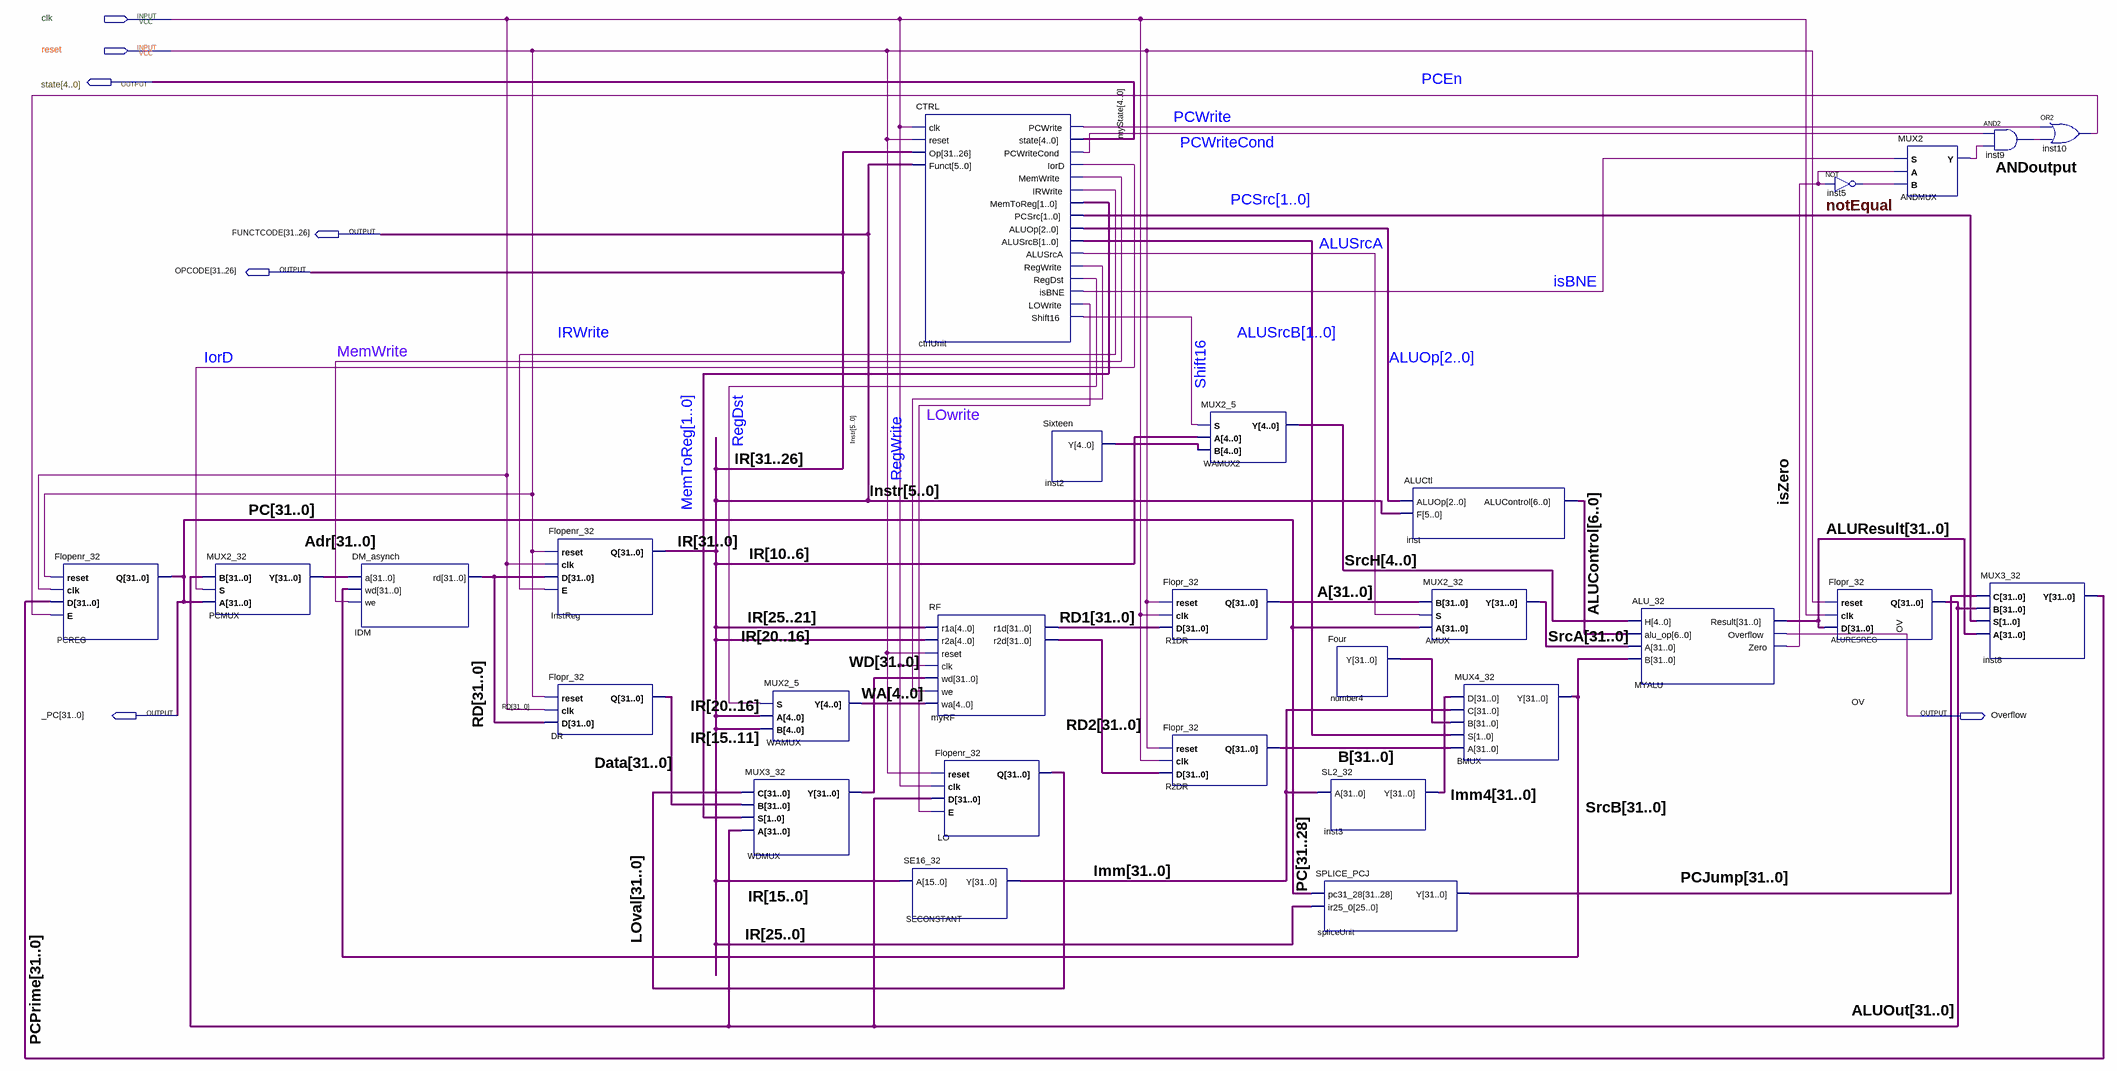
[diagram p0: schematic sheet]
// Quartus schematic CPU_MultiCycle.bdf as structural Verilog: 28 symbols, 7 pins
module CPU_MultiCycle (
  input  clk,
  input  reset,
  output [4:0] state,
  output [31:26] FUNCTCODE,
  output [31:26] OPCODE,
  output [31:0] _PC,
  output Overflow
);

  wire ALUSrcA, ANDMUX_y, ANDoutput, IorD, IRWrite, isBNE, isZero, LOwrite, MemWrite, notEqual, PCEn,
       PCWrite, PCWriteCond, RegDst, RegWrite, Shift16;
  wire [1:0] ALUSrcB, MemToReg, PCSrc;
  wire [2:0] ALUOp;
  wire [4:0] inst2_y, SrcH, WA;
  wire [6:0] ALUControl;
  wire [25:0] IR;
  wire [31:0] A, Adr, ALUOut, ALUResult, B, Data, Imm, Imm4, LOval, number4_y, PCJump, PCPrime, RD, RD1, RD2,
       SrcA, SrcB, WD;

  Flopenr_32 PCREG (.reset(reset), .clk(clk), .D(PCPrime), .E(PCEn), .Q(_PC));
  MUX2_32 PCMUX (.B(ALUOut), .S(IorD), .A(_PC), .Y(Adr));
  DM_asynch IDM (.a(Adr), .wd(SrcB), .we(MemWrite), .rd(RD));
  Flopenr_32 InstReg (.reset(reset), .clk(clk), .D(RD), .E(IRWrite), .Q({OPCODE, IR}));
  Flopr_32 DR (.reset(reset), .clk(clk), .D(RD), .Q(Data));
  MUX3_32 WDMUX (.C(LOval), .B(Data), .S(MemToReg), .A(ALUOut), .Y(WD));
  MUX2_5 WAMUX (.S(RegDst), .A(IR[20:16]), .B(IR[15:11]), .Y(WA));
  SE16_32 SECONSTANT (.A(IR[15:0]), .Y(Imm));
  CTRL ctrlUnit (
    .clk(clk), .reset(reset), .Op(OPCODE), .Funct(FUNCTCODE), .PCWrite(PCWrite), .state(state),
    .PCWriteCond(PCWriteCond), .IorD(IorD), .MemWrite(MemWrite), .IRWrite(IRWrite), .MemToReg(MemToReg),
    .PCSrc(PCSrc), .ALUOp(ALUOp), .ALUSrcB(ALUSrcB), .ALUSrcA(ALUSrcA), .RegWrite(RegWrite), .RegDst(RegDst),
    .isBNE(isBNE), .LOWrite(LOwrite), .Shift16(Shift16));
  RF myRF (
    .r1a(IR[25:21]), .r2a(IR[20:16]), .reset(reset), .clk(clk), .wd(WD), .we(RegWrite), .wa(WA), .r1d(RD1),
    .r2d(RD2));
  Flopenr_32 LO (.reset(reset), .clk(clk), .D(ALUOut), .E(LOwrite), .Q(LOval));
  Sixteen inst2 (.Y(inst2_y));
  Flopr_32 R1DR (.reset(reset), .clk(clk), .D(RD1), .Q(A));
  Flopr_32 R2DR (.reset(reset), .clk(clk), .D(RD2), .Q(B));
  MUX2_5 WAMUX2 (.S(Shift16), .A(IR[10:6]), .B(inst2_y), .Y(SrcH));
  SPLICE_PCJ spliceUnit (.pc31_28(_PC[31:28]), .ir25_0(IR), .Y(PCJump));
  Four number4 (.Y(number4_y));
  SL2_32 inst3 (.A(Imm), .Y(Imm4));
  ALUCtl inst (.ALUOp(ALUOp), .F(FUNCTCODE), .ALUControl(ALUControl));
  MUX2_32 AMUX (.B(A), .S(ALUSrcA), .A(_PC), .Y(SrcA));
  MUX4_32 BMUX (.D(Imm4), .C(Imm), .B(number4_y), .S(ALUSrcB), .A(B), .Y(SrcB));
  ALU_32 MYALU (
    .H(SrcH), .alu_op(ALUControl), .A(SrcA), .B(SrcB), .Result(ALUResult), .Overflow(Overflow), .Zero(isZero));
  not inst5 (notEqual, isZero);
  Flopr_32 ALURESREG (.reset(reset), .clk(clk), .D(ALUResult), .Q(ALUOut));
  MUX2 ANDMUX (.S(isBNE), .A(isZero), .B(notEqual), .Y(ANDMUX_y));
  and inst9 (ANDoutput, PCWriteCond, ANDMUX_y);
  MUX3_32 inst8 (.C(PCJump), .B(ALUOut), .S(PCSrc), .A(ALUResult), .Y(PCPrime));
  or inst10 (PCEn, PCWrite, ANDoutput);

  // Other names for the same wires on the sheet: Instr[5:0] = FUNCTCODE; IR[31:26] = OPCODE; OV = Overflow;
  //   PC[31:0] = _PC; myState[4:0] = state
endmodule
